# EAGLE design Adafruit STEMMA Analog SPDT Switch (EAGLE 9.6.2)
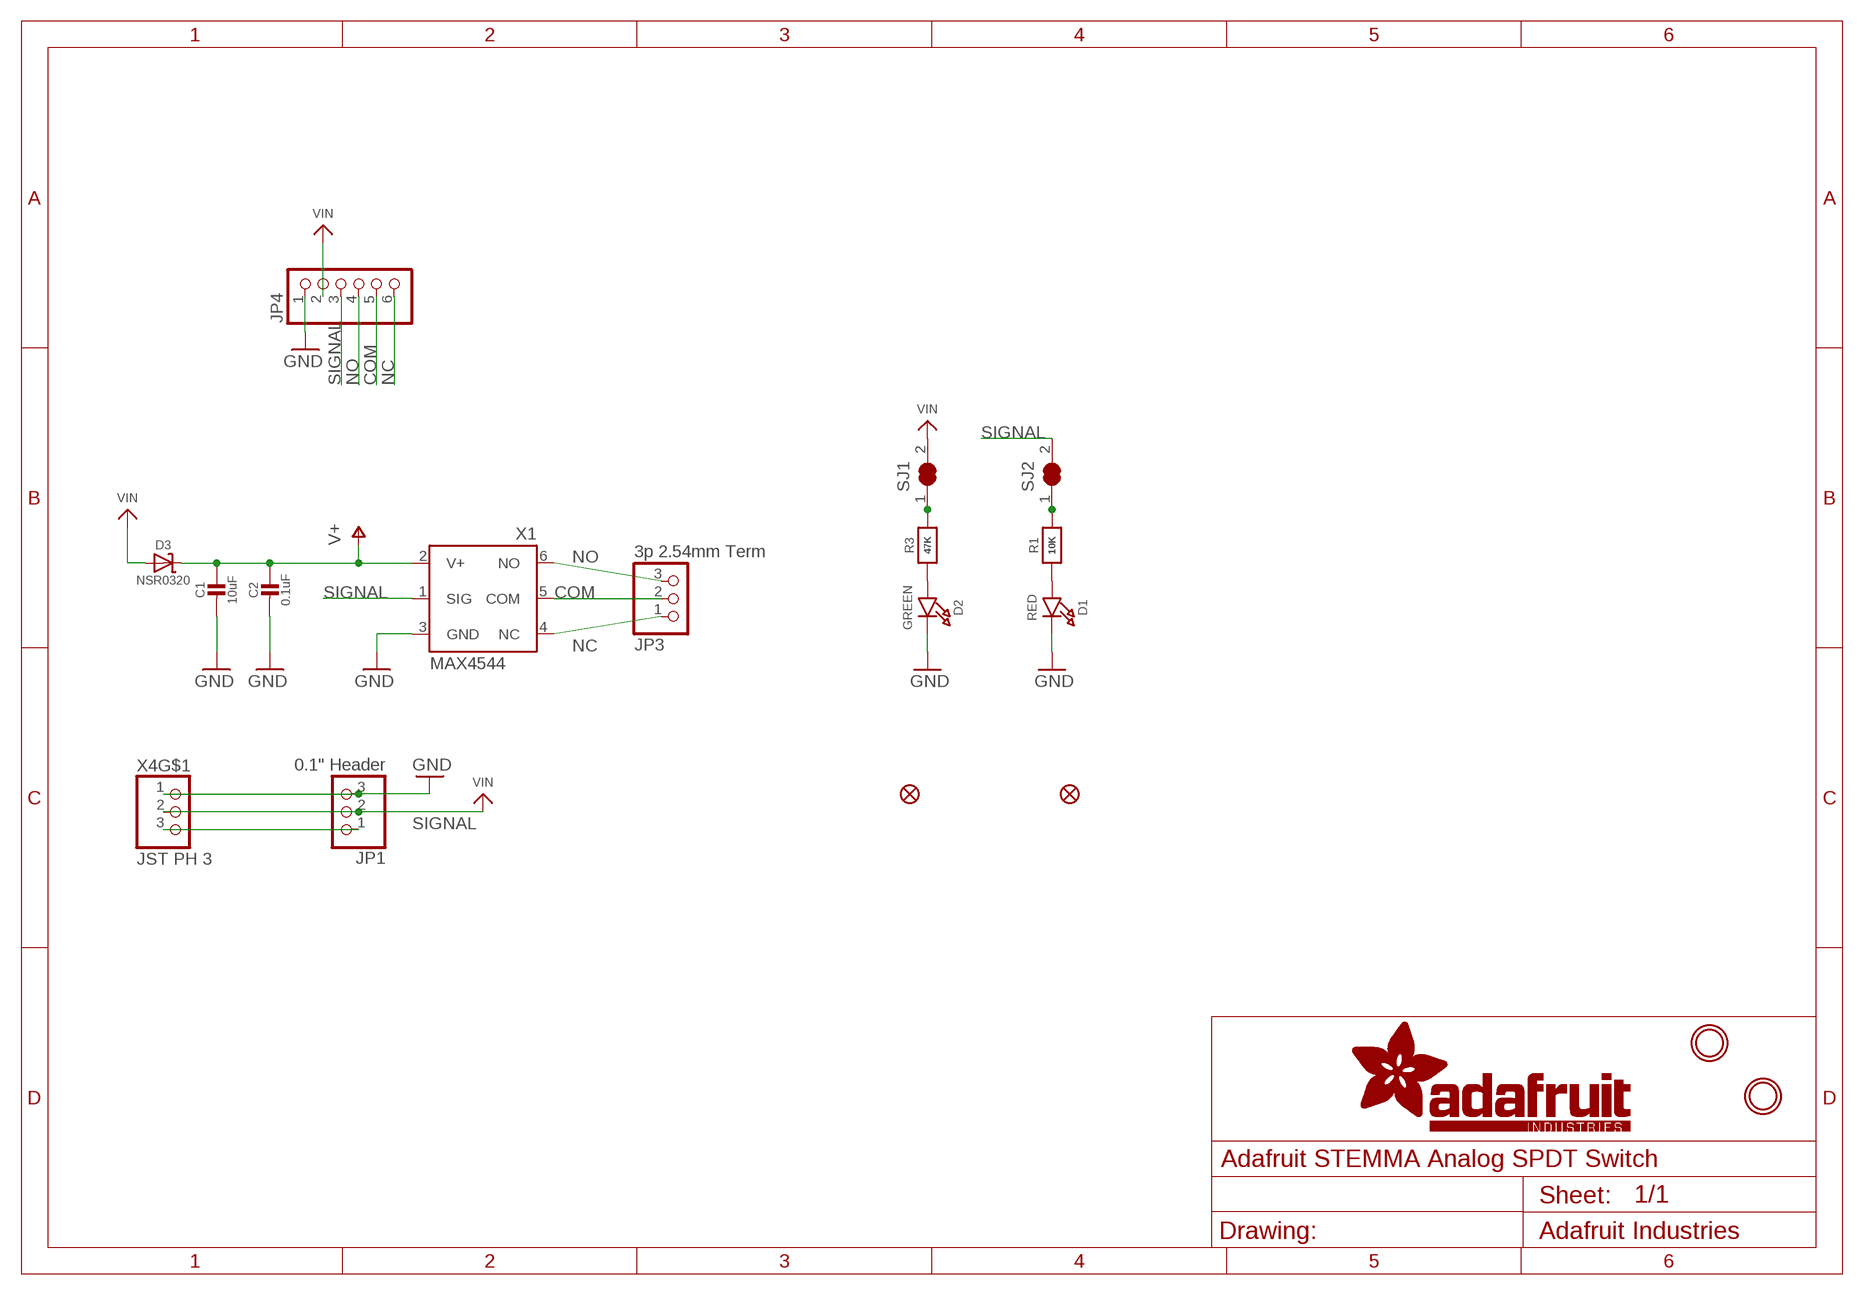
[diagram p0: schematic, sheet 1]

## Parts
C1  10uF  CAP_CERAMIC0805-NOOUTLINE  [0805-NO]
C2  0.1uF  CAP_CERAMIC0603_NO  [0603-NO]
D1  RED  LED0603_NOOUTLINE  [CHIPLED_0603_NOOUTLINE]
D2  GREEN  LED0603_NOOUTLINE  [CHIPLED_0603_NOOUTLINE]
D3  NSR0320  DIODE-SCHOTTKYSOD-323  [SOD-323]
FID2  FIDUCIAL_1MM  [FIDUCIAL_1MM]
FID3  FIDUCIAL_1MM  [FIDUCIAL_1MM]
JP1  0.1" Header  HEADER-1X3  [1X03_OVAL]
JP3  3p 2.54mm Term  HEADER-1X3_254TERM  [1X03_2.54MMTERMINAL]
JP4  HEADER-1X676MIL_FULLROUND  [1X06_ROUND_FULL_76]
R1  10K  RESISTOR_0603_NOOUT  [0603-NO]
R3  47K  RESISTOR_0603_NOOUT  [0603-NO]
SJ1  SOLDERJUMPER_CLOSED  [SOLDERJUMPER_CLOSEDWIRE]
SJ2  SOLDERJUMPER_CLOSED  [SOLDERJUMPER_CLOSEDWIRE]
U$1  MOUNTINGHOLE2.5  [MOUNTINGHOLE_2.5_PLATED]
U$8  MOUNTINGHOLE2.5  [MOUNTINGHOLE_2.5_PLATED]
X1  MAX4544  COS4561  [SOT23-6]
X4  JST PH 3  CON_JST_PH_3PIN  [JSTPH3]

## Nets
COM: JP3.2 JP4.5 X1.5(COM)
GND: C1.2 C2.2 D1.C D2.C JP1.3 JP4.1 X1.3(GND) X4.1
N$1: R3.2 SJ1.1
N$2: D1.A R1.1
N$3: R1.2 SJ2.1
N$26: D2.A R3.1
NC: JP3.1 JP4.6 X1.4(NC)
NO: JP3.3 JP4.4 X1.6(NO)
SIGNAL: JP1.1 JP4.3 SJ2.2 X1.1(SIG) X4.3
V+: C1.1 C2.1 D3.C X1.2(V+)
VIN: D3.A JP1.2 JP4.2 SJ1.2 X4.2
Unconnected: X4.NC1(MT) X4.NC2(MT)

## Library data of the parts
C1 C2 = microbuilder:CAP_CERAMIC: Ceramic Capacitors For new designs, use the packages preceded by an '_' character since they are more reliable: The following footprints should be used on most boards: _0402 - Standard footprint for regular board layouts _0603 - Standard footprint for regular board layouts _0805 - Standard footprint for regular board layouts _1206 - Standard footprint for regular board layouts For extremely tight-pitch boards where space is at a premium, the following 'micro-pitch' footprints can be used (smaller pads, no silkscreen outline, etc.): _0402MP - Micro-pitch footprint for very dense/compact boards _0603MP - Micro-pitch footprint for very dense/compact boards _0805MP - Micro-pitch footprint for very dense/compact boards _1206MP - Micro-pitch footprint for very dense/compact boards
D1 D2 = microbuilder:LED: LED 0603 - 0603 Surface Mount Package 2mA: Green LED - Low Power (3.9mcd, 2ma, 1.7Vf) - Digikey: 475-2709-2-ND Orange LED - Low Power (9.8mcd, 2ma, 1.8Vf) - Digikey: 475-1194-2-ND Red LED - Low Power (5mcd, 2ma, 1.8Vf) - Digikey: 475-1195-2-ND Yellow LED - Low Power (7mcd, 2ma, 1.8Vf) - Digikey: 475-1196-2-ND 5mA: Blue LED - Low Power (17mcd, 5ma, 2.9Vf) - Digikey: LNJ937W8CRACT-ND 0805 - 0805 Surface Mount Package 2mA: Red LED (8.8mcd, 2mA, 1.8Vf, Clear) - Low Power [Digikey: 475-2510-1-ND] Green LED (5mcd, 2mA, 1.8Vf, Clear) - Low Power [Digikey: 475-2730-1-ND] Yellow LED (11.3mcd, 2mA, 1.8Vf, Clear) - Low Power [Digikey: 475-2555-1-ND] 20mA: Red LED (104mcd, 20mA, Diffused) - LS R976 [Digikey: 475-1278-6-ND] Red LED (12mcd, 20mA, 2.0Vf, Clear) - APT2012EC [Digikey: 754-1128-1-ND] Green LED (15mcd, 20mA, 2.2Vf, Clear) - APT2012GC [Digikey: 754-1131-1-ND] Orange LED (160mcd, 20mA, 2.1Vf, Clear) - APT2012SECK [Digikey: 754-1130-1-ND] 1206 - 1206 Surface Mount Package Green LED (26mcd, 20mA, Diffused) - LG N971 [Digikey: 475-1407-6-ND] Red LED (15mcd, 20mA, Diffused) - LH N974 [Digikey: 475-1416-6-ND] Cree - Cree High-Power Surface Mount LEDs XPEBWT-L1-0000-00D50 - White 111lm 350mA 2.9Vf 6200K 110° XTEAWT-00-0000-00000LEE3 - White 114lm 350mA 2.85Vf 5000K 115° Everlight - Everlight 45-21 Series Surface Mount LEDs 45-21/QK2C-B2832AC2CB2/2T - Warm White 2000mcd 20mA 3.25Vf 3050K 120° 45-21/LK2C-B38452C4CB2/2T - Nuetral White 2000mcd 20mA 3.25Vf 4150K 120° 45-21/LK2C-B50634C6CB2/2T - Cold White 2200mcd 20mA 3.25Vf 5650K 120° PLCC2 Reverse Mount LS T77K-J1L2-1-0-2-R18-Z - Red 11.25mcd 2mA 1.8Vf 630nm 120° LO T77K-L1M2-24-Z - Orange 19.6mcd 2mA 1.8Vf 606nm 120° LY T77K-K2M1-26-Z - Yellow 15.7mcd 2mA 1.8Vf 587nm 120°; ROT: 270
D3 = microbuilder:DIODE-SCHOTTKY
FID2 FID3 = microbuilder:FIDUCIAL: Fiducial Alignment Points Various fiducial points for machine vision alignment.; BOM: EXCLUDE
JP1 JP3 = microbuilder:HEADER-1X3: PIN HEADER
JP4 = microbuilder:HEADER-1X6: PIN HEADER
R1 R3 = microbuilder:RESISTOR: Resistors For new designs, use the packages preceded by an '_' character since they are more reliable: The following footprints should be used on most boards: _0402 - Standard footprint for regular board layouts _0603 - Standard footprint for regular board layouts _0805 - Standard footprint for regular board layouts _1206 - Standard footprint for regular board layouts For extremely tight-pitch boards where space is at a premium, the following 'micro-pitch' footprints can be used (smaller pads, no silkscreen outline, etc.): _0402MP - Micro-pitch footprint for very dense/compact boards _0603MP - Micro-pitch footprint for very dense/compact boards _0805MP - Micro-pitch footprint for very dense/compact boards _1206MP - Micro-pitch footprint for very dense/compact boards
SJ1 SJ2 = microbuilder:SOLDERJUMPER_CLOSED: Solder Jumper - Closed These solder jumpers are closed by default CLOSEDWIRE - 10 mil trace between pads that can be cut and resoldered later CLOSEDPERM - 63 mil trace between pads for a permanent connection (used to 'bridge' two signals, a shameless hack for Eagle). Can double as a test point as well (no cream layer)
U$1 U$8 = adafruit_electromech:MOUNTINGHOLE: Mounting Hole For #2 screws (0.086"/2.18mm width, 0.094"/2.4mm hole) use 2.5mm; BOM: EXCLUDE
X1 = microbuilder:COS4561
X4 = adafruit_electromech:CON_JST_PH_3PIN

## Net classes
1 HV: width 0.406 mm, drill 0.381 mm, clearance 0.762 mm

## Board
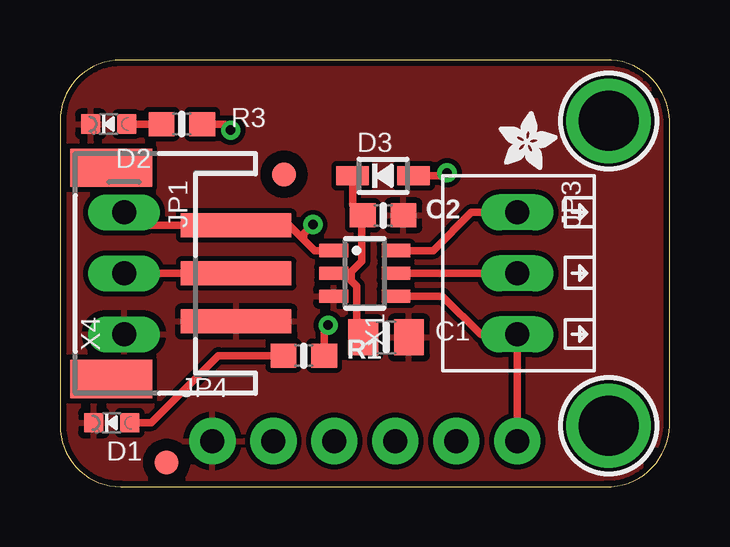
[diagram p1: board, top side]
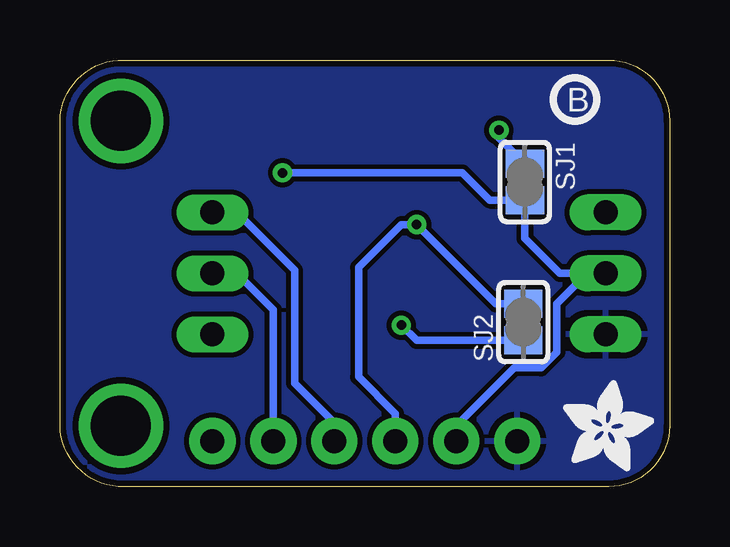
[diagram p2: board, bottom side, seen from below]

Size 25.4 x 17.78 mm. Coordinates in mm from the lower left corner, seen from the top.
Outline: 0,15.24 0,2.54 arc90 2.54,0 22.73,0 arc90 25.4,2.54 25.4,15.24 arc90 22.73,17.78 2.54,17.78 arc90 0,15.24
Copper layers (1*16): Top 0.035mm / dielectric 1.5mm / Bottom 0.035mm
Design rules "adafruit": minimum track width 8mil, minimum drill 15.5mil, track to track 8mil, track to pad 8mil, pad to pad 8mil, via to via 8mil, smd to smd 8mil, copper to edge 10mil, drill to drill 8mil, minimum pad ring 10mil, minimum via ring 8mil, stop-mask expansion 2mil, vias tented up to drill 20mil, thermal gap 10mil

### Footprints (pad centres in the part's own frame; a part is rotated, then mirrored left to right if it is on the bottom)
0805-NO = smd 1.24 x 1.5: 1 -0.95,0; 2 0.95,0
0603-NO = smd 1.075 x 1: 1 -0.85,0; 2 0.85,0
CHIPLED_0603_NOOUTLINE = smd 0.8 x 0.8: A 0,-0.75; C 0,0.75
SOD-323 = smd 1.35 x 0.8: A 1.27,0; C -1.27,0
FIDUCIAL_1MM = smd 1 x 1: 1 0,0
1X03_OVAL = drill 1 long: 1 -2.54,0; 2 0,0; 3 2.54,0
1X03_2.54MMTERMINAL = drill 1 long: 1 2.54,0; 2 0,0; 3 -2.54,0
1X06_ROUND_FULL_76 = drill 1 pad 1.93: 1 -6.35,0; 2 -3.81,0; 3 -1.27,0; 4 1.27,0; 5 3.81,0; 6 6.35,0
SOLDERJUMPER_CLOSEDWIRE = smd 1.168 x 1.6: 1 -0.762,0; 2 0.762,0 | smd 0.635 x 0.203: WIRE 0,0
MOUNTINGHOLE_2.5_PLATED = drill 2.5 pad 3.2: P$1 0,0
SOT23-6 = smd 0.55 x 1.2: 1 -0.95,-1.3; 2 0,-1.3; 3 0.95,-1.3; 4 0.95,1.3; 5 0,1.3; 6 -0.95,1.3
JSTPH3 = smd 1 x 4.6: 1 -2,-2.7; 2 0,-2.7; 3 2,-2.7 | smd 1.6 x 3.4: NC1 -4.4,2.5; NC2 4.4,2.5

### Placement (x,y rotation side)
C1  13.59,6.22 0 top
C2  13.46,11.3 0 top
D1  2.16,2.67 90 top
D2  2.03,15.11 90 top
D3  13.46,12.95 0 top
FID2  4.45,1.02 0 top
FID3  9.33,13.02 0 top
JP1  2.67,8.89 270 top
JP3  19.05,8.89 270 top
JP4  12.7,1.91 0 top
PLABEL0  [PLABEL0]  0.89,15.88 0 top
PLABEL1  [PLABEL1]  0.89,0.89 0 top
PLABEL2  [PLABEL2]  7.11,14.35 0 top
PLABEL3  [PLABEL3]  22.48,11.43 0 top
PLABEL4  [PLABEL4]  22.61,6.35 0 top
PLABEL5  [PLABEL5]  22.35,8.89 0 top
PLABEL6  [PLABEL6]  15.24,3.68 0 top
PLABEL7  [PLABEL7]  18.67,3.68 0 top
PLABEL8  [PLABEL8]  13.97,3.05 90 top
PLABEL9  [PLABEL9]  10.29,3.68 0 top
PLABEL10  [PLABEL10]  8.89,2.92 90 top
PLABEL11  [PLABEL11]  5.97,3.3 0 top
PLABEL12  [PLABEL12]  13.59,15.62 0 bottom
PLABEL13  [PLABEL13]  3.81,4.83 0 bottom
PLABEL14  [PLABEL14]  3.56,13.21 0 bottom
PLABEL15  [PLABEL15]  12.45,5.71 0 bottom
PLABEL16  [PLABEL16]  12.95,11.05 0 bottom
R1  10.16,5.46 0 top
R3  5.08,15.11 0 top
SJ1  6.03,12.7 270 bottom
SJ2  6.1,6.86 90 bottom
U$1  22.86,2.54 0 top
U$3  [PCBFEAT-REV-040]  3.94,16.13 0 bottom
U$8  22.86,15.24 0 top
U$12  [ADAFRUIT_3.5MM]  4.45,0.64 0 bottom
U$19  [ADAFRUIT_2.5MM]  18.29,13.21 0 top
X1  12.7,8.89 270 top
X4  4.64,8.89 90 top

### Tracks (layer width: path | path; a pad name or v marks a point on that pad's centre or on a via)
COM
  Top 0.305: X1.5 JP3.2
  Bottom 0.305: JP4.5 16.51,7.37 18.03,8.89 JP3.2
GND
  pour Top: 0,17.78 25.4,17.78 25.4,0 0,0
  pour Bottom: 0,17.78 25.4,17.78 25.4,0 0,0
N$1  (via drill 0.39)
  Top 0.305: R3.2 6.86,15.11 v7.11,14.86
  Bottom 0.305: v7.11,14.86 7.11,14.54 SJ1.1
N$2
  Top 0.305: D1.A 3.81,2.67 6.6,5.46 R1.1
N$3  (via drill 0.39)
  Top 0.305: R1.2 11.01,6.57 v11.18,6.73
  Bottom 0.305: v11.18,6.73 10.54,6.1 SJ2.1
N$26
  Top 0.305: D2.A R3.1
NC
  Top 0.305: X1.4 15.94,7.94 17.53,6.35 JP3.1 JP4.6
NO
  Top 0.305: X1.6 15.55,9.84 17.14,11.43 JP3.3
  Bottom 0.305: JP4.4 13.97,2.67 15.62,4.32 15.62,9.02 18.03,11.43 JP3.3
SIGNAL  (via drill 0.39)
  Top 0.305: X1.1 10.61,9.84 10.16,10.29 | 10.16,10.29 9.56,10.89 X4.3 3.21,10.89 JP1.1 | v10.54,10.92 10.16,10.54 10.16,10.29
  Bottom 0.305: SJ2.2 7.24,7.62 v10.54,10.92 11.18,10.92 12.95,9.14 12.95,4.57 11.43,3.05 JP4.3
V+
  Top 0.305: X1.2 12.06,8.89 12.13,8.95 | 12.13,8.95 12.57,9.4 12.57,11.26 C2.1 12.19,11.72 D3.C | C1.1 12.64,6.74 12.38,6.92 12.36,6.95 12.36,8.36 12.13,8.59 12.13,8.95
VIN  (via drill 0.39)
  Top 0.305: X4.2 JP1.2 | D3.A 16,12.95 v16.13,13.08
  Bottom 0.305: JP4.2 8.89,2.54 6.48,4.95 5.35,4.95 4.7,5.61 4.7,7.62 3.43,8.89 JP1.2 4.57,8.89 6.03,10.35 SJ1.2 7.49,11.94 8.64,13.08 v16.13,13.08

### Text on the board
Pinguin_tBackup: ON | MAX4544 3-12V / Analog Switch | NO | COM | NC | SIG | NO | COM | NC | - | V+ | Sig
Pinguin_bBackup: MAX4544 SPDT / Analog Switch | ON | Break / Before / Make | VIN:2.7~12V / Signals must / be <= VIN! | SIG